# Altium schematic sheet TFCard.SchDoc
size A4
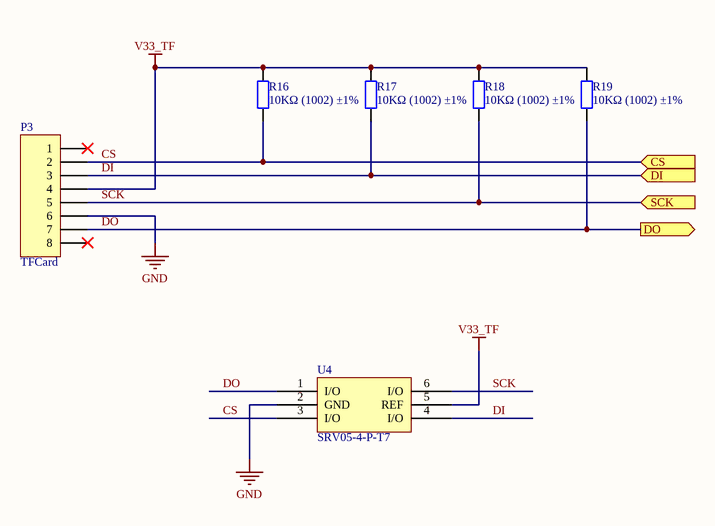
[diagram p0: TFCard.SchDoc]

## Parts
P3  TFCard  [TF002]
R16  10KΩ (1002) ±1%  [0402_R]
R17  10KΩ (1002) ±1%  [0402_R]
R18  10KΩ (1002) ±1%  [0402_R]
R19  10KΩ (1002) ±1%  [0402_R]
U4  SRV05-4-P-T7  [SOT-23-6]

## Ports
CS (in), DI (in), DO (out), SCK (in)

## Nets
GND: P3.6 U4.2(GND)
V33_TF: P3.4 R16.2 R17.2 R18.2 R19.2 U4.5(REF)
CS: P3.2 R16.1 U4.3(I/O) ; port CS
DI: P3.3 R17.1 U4.4(I/O) ; port DI
DO: P3.7 R19.1 U4.1(I/O) ; port DO
SCK: P3.5 R18.1 U4.6(I/O) ; port SCK

Not connected (* = marked no-connect by the designer): P3 1* 8*

## Library data of the parts
P3 = Header 8: Header, 8-Pin; LatestRevisionDate: 17-Jul-2002; LatestRevisionNote: Re-released for DXP Platform.; Publisher: Altium Limited
R16-R19 = 0402 10KΩ (1002) 1%: 贴片电阻; ComponentLink1Description: 供应商链接; ComponentLink1URL: http://www.szlcsc.com/product/details_26487.html; Package: 0402; Supplier: LC; SuppliersPartNumber: C25744
U4 = SRV05-4-P-T7_[C85364]: TVS; ComponentLink1Description: 供应商链接; ComponentLink1URL: http://www.szlcsc.com/product/details_86537.html; Package: SOT-23-6; Supplier: LC; SuppliersPartNumber: C85364